# Altium schematic sheet 电源.SchDoc
size A3; Organization: Altium Limited; Address1: L3, 12a Rodborough Rd; Address2: Frenchs Forest; Address3: NSW; Address4: Australia 2086
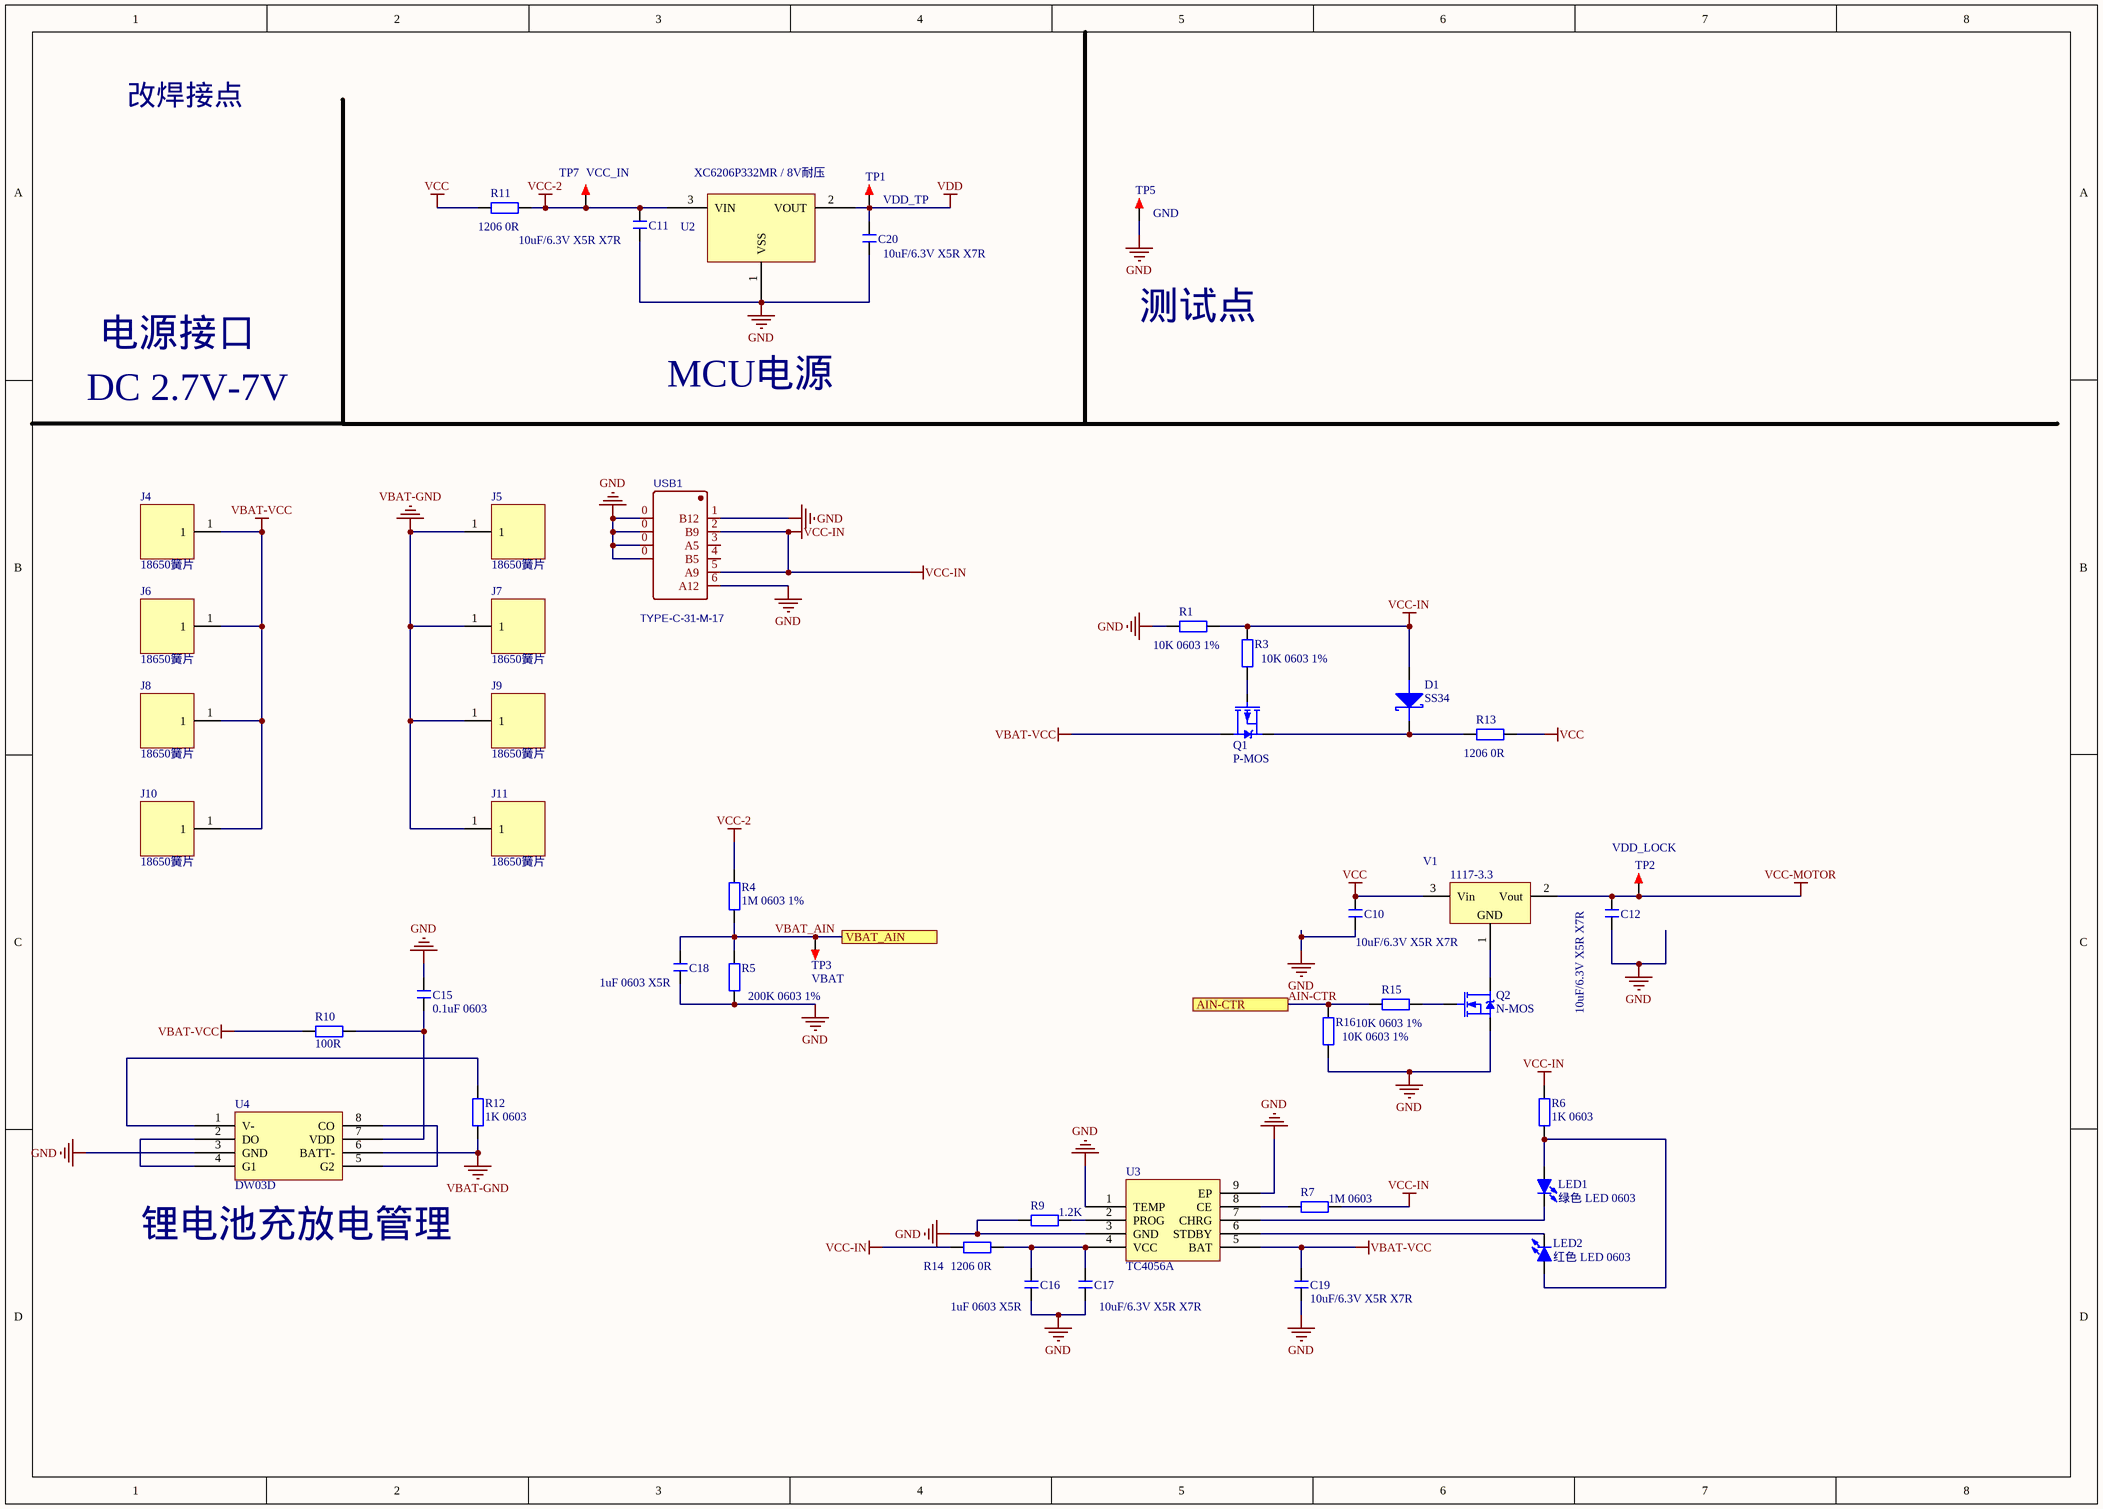
[diagram p0: 电源.SchDoc]

## Parts
C10  10uF/6.3V X5R X7R  [C 0603]
C11  10uF/6.3V X5R X7R  [C 0603]
C12  10uF/6.3V X5R X7R  [C 0603]
C15  0.1uF 0603  [C 0603]
C16  1uF 0603 X5R  [C 0603]
C17  10uF/6.3V X5R X7R  [C 0603]
C18  1uF 0603 X5R  [C 0603]
C19  10uF/6.3V X5R X7R  [C 0603]
C20  10uF/6.3V X5R X7R  [C 0603]
D1  SS34  [SMA/DO-214AC]
J4  18650簧片  [18650电池簧片]
J5  18650簧片  [18650电池簧片]
J6  18650簧片  [18650电池簧片]
J7  18650簧片  [18650电池簧片]
J8  18650簧片  [18650电池簧片]
J9  18650簧片  [18650电池簧片]
J10  18650簧片  [18650电池簧片]
J11  18650簧片  [18650电池簧片]
LED1  绿色 LED 0603  [LED 0603G]
LED2  红色 LED 0603  [LED 0603G]
Q1  P-MOS  [SOT23]
Q2  N-MOS  [SOT23]
R1  10K 0603 1%  [R 0603]
R3  10K 0603 1%  [R 0603]
R4  1M 0603 1%  [R 0603]
R5  200K 0603 1%  [R 0603]
R6  1K 0603  [R 0603]
R7  1M 0603  [R 0603]
R9  1.2K  [R 0603]
R10  100R  [R 0603]
R11  1206 0R  [R 1206]
R12  1K 0603  [R 0603]
R13  1206 0R  [R 1206]
R14  1206 0R  [R 1206]
R15  10K 0603 1%  [R 0603]
R16  10K 0603 1%  [R 0603]
TP1  VDD_TP  [TEST 1]
TP2  VDD_LOCK  [TEST 1]
TP3  VBAT  [TEST 1]
TP5  GND  [TEST 1]
TP7  VCC_IN  [TEST 1]
U2  XC6206P332MR / 8V耐压  [SOT23-3]
U3  TC4056A  [SOP-8_L4.9-W3.9-P1.27-LS6.0-BL-EP]
U4  DW03D  [TSSOP-8_L4.4-W3.0-P0.65-LS6.4-BL]
USB1  TYPE-C-31-M-17  [USB-TYPE-C-SMD6]
V1  1117-3.3  [SOT223_L]

## Ports
AIN-CTR, VBAT_AIN

## Nets
GND: C10.1 C11.1 C12.1 C15.2 C16.2 C17.2 C18.1 C19.2 C20.1 Q2.S R1.2 R5.1 R9.2 R16.2 TP5.1 U2.1(VSS) U3.1(TEMP) U3.3(GND) U3.9(EP) U4.3(GND) USB1.0 USB1.1(B12) USB1.6(A12)
VBAT-GND: J5.1 J7.1 J9.1 J11.1 R12.1 U4.6(BATT-)
VBAT-VCC: C19.1 J4.1 J6.1 J8.1 J10.1 Q1.D R10.2 U3.5(BAT)
VCC: C10.2 R11.1 R13.2 V1.3(Vin)
VCC-2: C11.2 R4.1 R11.2 TP7.1 U2.3(VIN)
VCC-IN: D1.A R1.1 R3.1 R6.1 R7.1 R14.1 USB1.2(B9) USB1.5(A9)
VCC-MOTOR: C12.2 TP2.1 V1.2(Vout)
VDD: C20.2 TP1.1 U2.2(VOUT)
AIN-CTR: R15.2 R16.1 ; port AIN-CTR
VBAT_AIN: C18.2 R4.2 R5.2 TP3.1 ; port VBAT_AIN
NetC15_1: C15.1 R10.1 U4.7(VDD)
NetC16_1: C16.1 C17.1 R14.2 U3.4(VCC)
NetD1_K: D1.K Q1.S R13.1
NetLED1_1: LED1.1(A) LED2.1(A) R6.2
NetLED1_2: LED1.2(K) U3.7(CHRG)
NetLED2_2: LED2.2(K) U3.6(STDBY)
NetQ1_G: Q1.G R3.2
NetQ2_D: Q2.D V1.1(GND)
NetQ2_G: Q2.G R15.1
NetR7_2: R7.2 U3.8(CE)
NetR9_1: R9.1 U3.2(PROG)
NetR12_2: R12.2 U4.1(V-)
NetU4_2: U4.2(DO) U4.4(G1)
NetU4_5: U4.5(G2) U4.8(CO)

Not connected (* = marked no-connect by the designer): USB1 3(A5) 4(B5)

## Notes on the sheet
- 改焊接点
- 电源接口
- 测试点
- DC 2.7V-7V
- MCU电源
- (near U4) 锂电池充放电管理
- Title
- Size:
- Date:
- A4
- Number:
- Time:
- Revision:
- Sheet
- of
- File:

## Library data of the parts
C10-C12 C15-C20 = C: 无极性贴片电容; 版权归属: 源创客; BOM名称: 无极性贴片电容; 学习资源: www.ooocke.com
D1 = DIODE SCHOTTKY: 肖特基二极管
LED1 LED2 = LED-SMD: 贴片LED; 版权归属: 源创客; BOM名称: 贴片LED; 学习资源: www.ooocke.com
Q1 = P-MOS: P沟道场效应管
Q2 = N-MOS: N沟道场效应管
R1 R3-R7 R9-R16 = R: 贴片电阻; 版权归属: 源创客; BOM名称: 贴片电阻; 学习资源: www.ooocke.com
TP1-TP3 TP5 TP7 = TEST TP: 测试环; 版权归属: 源创客; BOM名称: 测试环; 学习资源: www.ooocke.com
U2 = XC6206P252MR: LDO
U3 = TC4056A: 锂电池充电IC
U4 = DW03D: 充电保护IC
V1 = AMS1117: 三端稳压芯片; BOM名称: 稳压芯片; 版权归属: 源创客; 学习资源: www.ooocke.com